# Altium project bat2_project.prjpcb
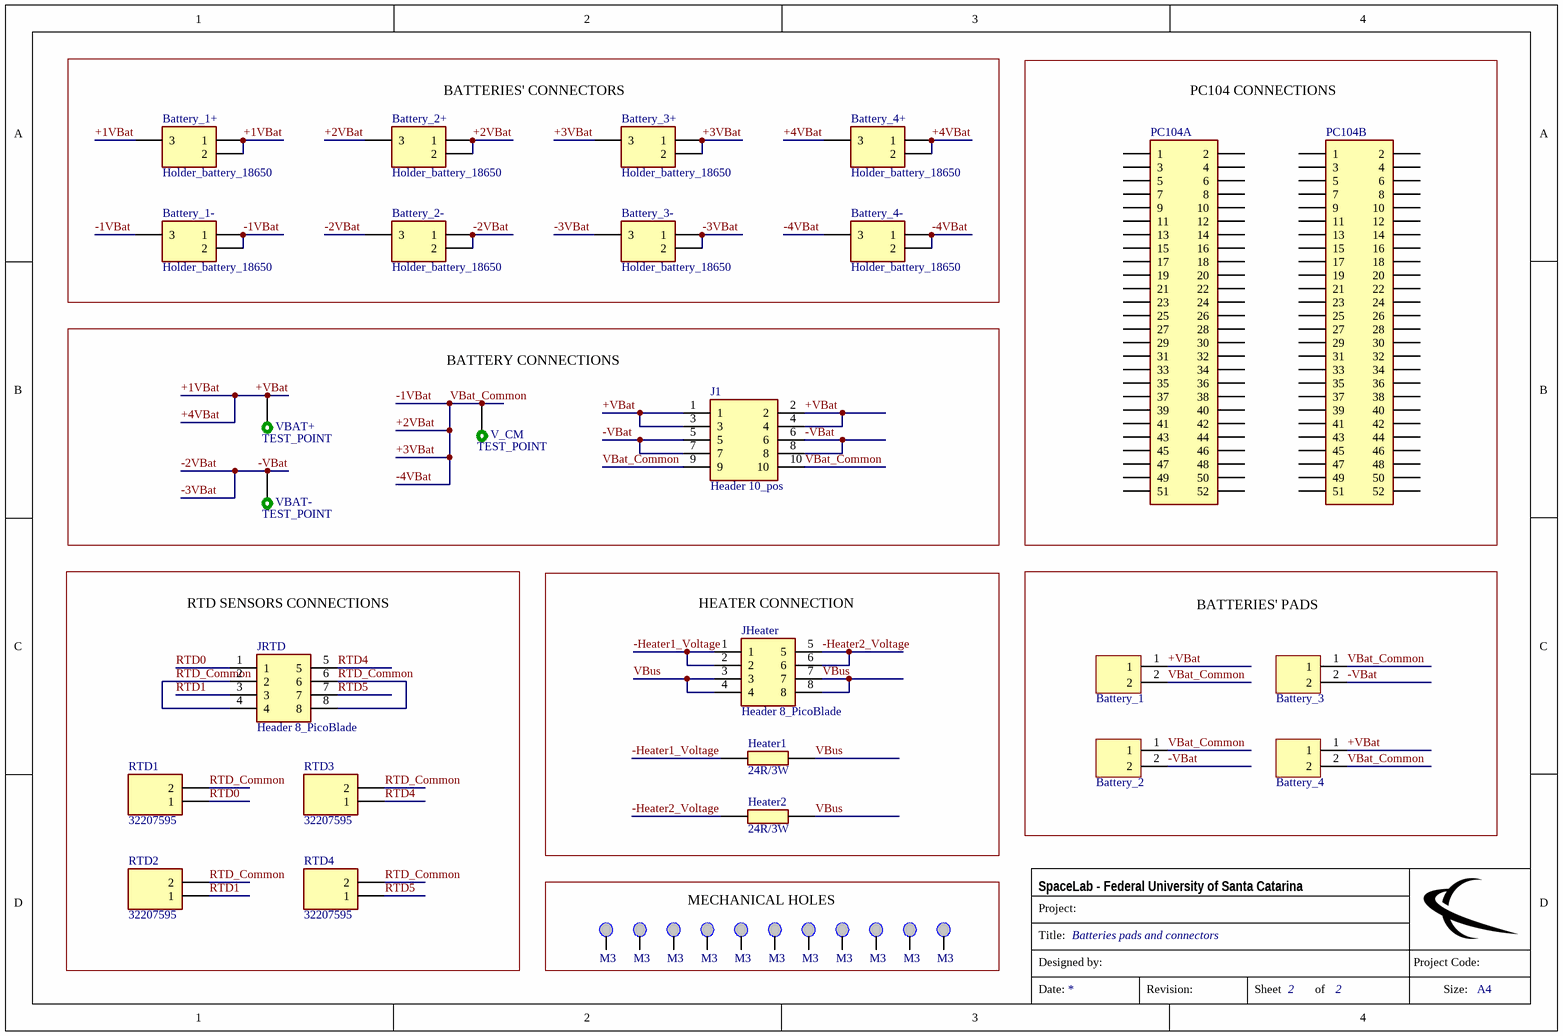
[diagram p0: board_schematic.schdoc]
1 sheet, 37 parts. Net scope: global (net labels, ports and power ports of the same name join across sheets).
Board file: board_layout.pcbdoc

## Sheet board_schematic.schdoc: Batteries pads and connectors
size A4; Designed by: Amanda Batista Medeiros; Organization: UFSC; DocumentNumber: 2; SheetNumber: 2; SheetTotal: 2

### Parts
Battery_1  BATTERY  [BATTERY]  (value not drawn)  (no BOM)
Battery_1+  Holder_battery_18650  [54]
Battery_1-  Holder_battery_18650  [54]
Battery_2  BATTERY  [BATTERY]  (value not drawn)  (no BOM)
Battery_2+  Holder_battery_18650  [54]
Battery_2-  Holder_battery_18650  [54]
Battery_3  BATTERY  [BATTERY]  (value not drawn)  (no BOM)
Battery_3+  Holder_battery_18650  [54]
Battery_3-  Holder_battery_18650  [54]
Battery_4  BATTERY  [BATTERY]  (value not drawn)  (no BOM)
Battery_4+  Holder_battery_18650  [54]
Battery_4-  Holder_battery_18650  [54]
H1  M3  [M3 hole]  (no BOM)
H2  M3  [M3 hole]  (no BOM)
H3  M3  [M3 hole]  (no BOM)
H4  M3  [M3 hole]  (no BOM)
H5  M3  [M3 hole]  (no BOM)
H6  M3  [M3 hole]  (no BOM)
H7  M3  [M3 hole]  (no BOM)
H8  M3  [M3 hole]  (no BOM)
H9  M3  [M3 hole]  (no BOM)
H10  M3  [M3 hole]  (no BOM)
H11  M3  [M3 hole]  (no BOM)
Heater1  24R/3W  [RESAD3322W86L1422D475]
Heater2  24R/3W  [RESAD3322W86L1422D475]
J1  Header 10_pos  [HDRV10W64P254_2X5_1270X502X521P]
JHeater  Header 8_PicoBlade  [532610871]
JRTD  Header 8_PicoBlade  [532610871]
PC104A  ESQ-126-39-G-D  [ESQ-126-Y-X-D]  (value not drawn)
PC104B  ESQ-126-39-G-D  [ESQ-126-Y-X-D]  (value not drawn)
RTD1  32207595  [THRMC3216X70N]
RTD2  32207595  [THRMC3216X70N]
RTD3  32207595  [THRMC3216X70N]
RTD4  32207595  [THRMC3216X70N]
V_CM  TEST_POINT  [Test_Point]
VBAT+  TEST_POINT  [Test_Point]
VBAT-  TEST_POINT  [Test_Point]

### Blocks framed on the sheet
BATTERIES' CONNECTORS: Battery_1+ Battery_1- Battery_2+ Battery_2- Battery_3+ Battery_3- Battery_4+ Battery_4-
PC104 CONNECTIONS: PC104A PC104B
BATTERY CONNECTIONS: J1 V_CM VBAT+ VBAT-
RTD SENSORS CONNECTIONS: JRTD RTD1-RTD4
HEATER CONNECTION: Heater1 Heater2 JHeater
BATTERIES' PADS: Battery_1-Battery_4
MECHANICAL HOLES: H1-H11

### Nets
+1VBat: Battery_1.1 Battery_1+.1 Battery_1+.2 Battery_1+.3 Battery_4.1 Battery_4+.1 Battery_4+.2 Battery_4+.3 J1.1 J1.2 J1.3 J1.4 VBAT+.1  [also labelled +4VBat, +VBat]
+2VBat: Battery_1.2 Battery_1-.1 Battery_1-.2 Battery_1-.3 Battery_2.1 Battery_2+.1 Battery_2+.2 Battery_2+.3 Battery_3.1 Battery_3+.1 Battery_3+.2 Battery_3+.3 Battery_4.2 Battery_4-.1 Battery_4-.2 Battery_4-.3 J1.9 J1.10 V_CM.1  [also labelled +3VBat, -1VBat, -4VBat, VBat_Common]
-2VBat: Battery_2.2 Battery_2-.1 Battery_2-.2 Battery_2-.3 Battery_3.2 Battery_3-.1 Battery_3-.2 Battery_3-.3 J1.5 J1.6 J1.7 J1.8 VBAT-.1  [also labelled -3VBat, -VBat]
-Heater1_Voltage: Heater1.1 JHeater.1 JHeater.2
-Heater2_Voltage: Heater2.1 JHeater.5 JHeater.6
RTD0: JRTD.1 RTD1.1
RTD1: JRTD.3 RTD2.1
RTD4: JRTD.5 RTD3.1
RTD5: JRTD.7 RTD4.1
RTD_Common: JRTD.2 JRTD.4 JRTD.6 JRTD.8 RTD1.2 RTD2.2 RTD3.2 RTD4.2
VBus: Heater1.2 Heater2.2 JHeater.3 JHeater.4 JHeater.7 JHeater.8

Not connected (* = marked no-connect by the designer): H1 0; H2 0; H3 0; H4 0; H5 0; H6 0; H7 0; H8 0; H9 0; H10 0; H11 0; PC104A 1 2 3 4 5 6 7 8 9 10 11 12 13 14 15 16 17 18 19 20 21 22 23 24 25 26 27 28 29 30 31 32 33 34 35 36 37 38 39 40 41 42 43 44 45 46 47 48 49 50 51 52; PC104B 1 2 3 4 5 6 7 8 9 10 11 12 13 14 15 16 17 18 19 20 21 22 23 24 25 26 27 28 29 30 31 32 33 34 35 36 37 38 39 40 41 42 43 44 45 46 47 48 49 50 51 52

### Notes on the sheet
- Project:
- SpaceLab - Federal University of Santa Catarina
- Title:
- Designed by:
- Project Code:
- Date:
- Revision:
- Sheet
- of
- Size:
- A4

### Library data of the parts
Battery_1-Battery_4 = BATTERY: Battery Pads
Battery_1+ Battery_1- Battery_2+ Battery_2- Battery_3+ Battery_3- Battery_4+ Battery_4- = 54: Cylindrical Battery Contacts, Clips, Holders & Springs 16-19mm PC BATTERY CLIP; Manufacturer_Name: Keystone Electronics; Allied_Number: 70229904; Datasheet Link: http://www.farnell.com/datasheets/1703960.pdf; Manufacturer_Part_Number: 54; Mouser Part Number: 534-54; Mouser Price/Stock: https://www.mouser.co.uk/ProductDetail/Keystone-Electronics/54?qs=73q%2FgRcW4F3NakoJDesViw%3D%3D; Allied Price/Stock: http://www.alliedelec.com/keystone-electronics-54/70229904/
H1-H11 = M3 hole
Heater1 Heater2 = RS02B24R00FE12: Wirewound Resistors - Through Hole 3watts 24ohms 1%; Manufacturer_Name: Vishay; Allied_Number: 71331327; Datasheet Link: https://www.vishay.com/docs/30204/rsns.pdf; Manufacturer_Part_Number: RS02B24R00FE12; Allied Price/Stock: https://www.alliedelec.com/vishaydale-rs02b24r00fe12/71331327/
J1 = 67996-110HLF: Connector; Manufacturer_Name: SAMTEC; Height: 5.84mm; Manufacturer_Part_Number: 67996-110HLF; Mouser Part Number: 649-67996-110HLF; Mouser Price/Stock: https://br.mouser.com/ProductDetail/?qs=zh4O8xspOuxgf2RA9jR3ZQ%3D%3D
JHeater JRTD = 53261-0871: Connector Header Surface Mount, Right Angle 8 position 0.049" (1.25mm); Manufacturer_Name: Molex; Manufacturer_Part_Number: 53398-0871; Datasheet Link: http://www.molex.com/webdocs/datasheets/pdf/en-us/0533980871_PCB_HEADERS.pdf; Arrow Part Number: 53398-0871; Arrow Price/Stock: https://www.arrow.com/en/products/53398-0871/molex; Mouser Part Number: 538-53398-0871; Mouser Price/Stock: https://www.mouser.co.uk/ProductDetail/Molex/53398-0871?qs=yqtfsgZKt1RXEPdc98IXkw%3D%3D
PC104A PC104B = ESQ-126-39-G-D: PC / 104 Connectors .100" PC/104 Elevated Socket Strip; Manufacturer_Name: SAMTEC; Datasheet Link: http://suddendocs.samtec.com/catalog_english/esq_th.pdf; Height: 13.84mm; Manufacturer_Part_Number: ESQ-126-39-G-D; Mouser Part Number: 200-ESQ12639GD; Mouser Price/Stock: https://www.mouser.co.uk/ProductDetail/Samtec/ESQ-126-39-G-D?qs=Cqqh%252BS766wm7W672HSOlSA%3D%3D; RS Part Number: 1595654; RS Price/Stock: http://uk.rs-online.com/web/p/products/1595654
RTD1-RTD4 = 32207595: Board Mount Temperature Sensors SMD1206(V) Pt 1000 Class B -50 to +130C; Manufacturer_Name: Heraeus Nexensos; Datasheet Link: https://componentsearchengine.com/Datasheets/1/32207595.pdf; Height: 0.7mm; Manufacturer_Part_Number: 32207595
V_CM VBAT+ VBAT- = TEST_POINT: Test Point - Headers & Wire Housings .100" Terminal Strip